# EAGLE design ESP8266 Encoder (EAGLE 9.6.2)
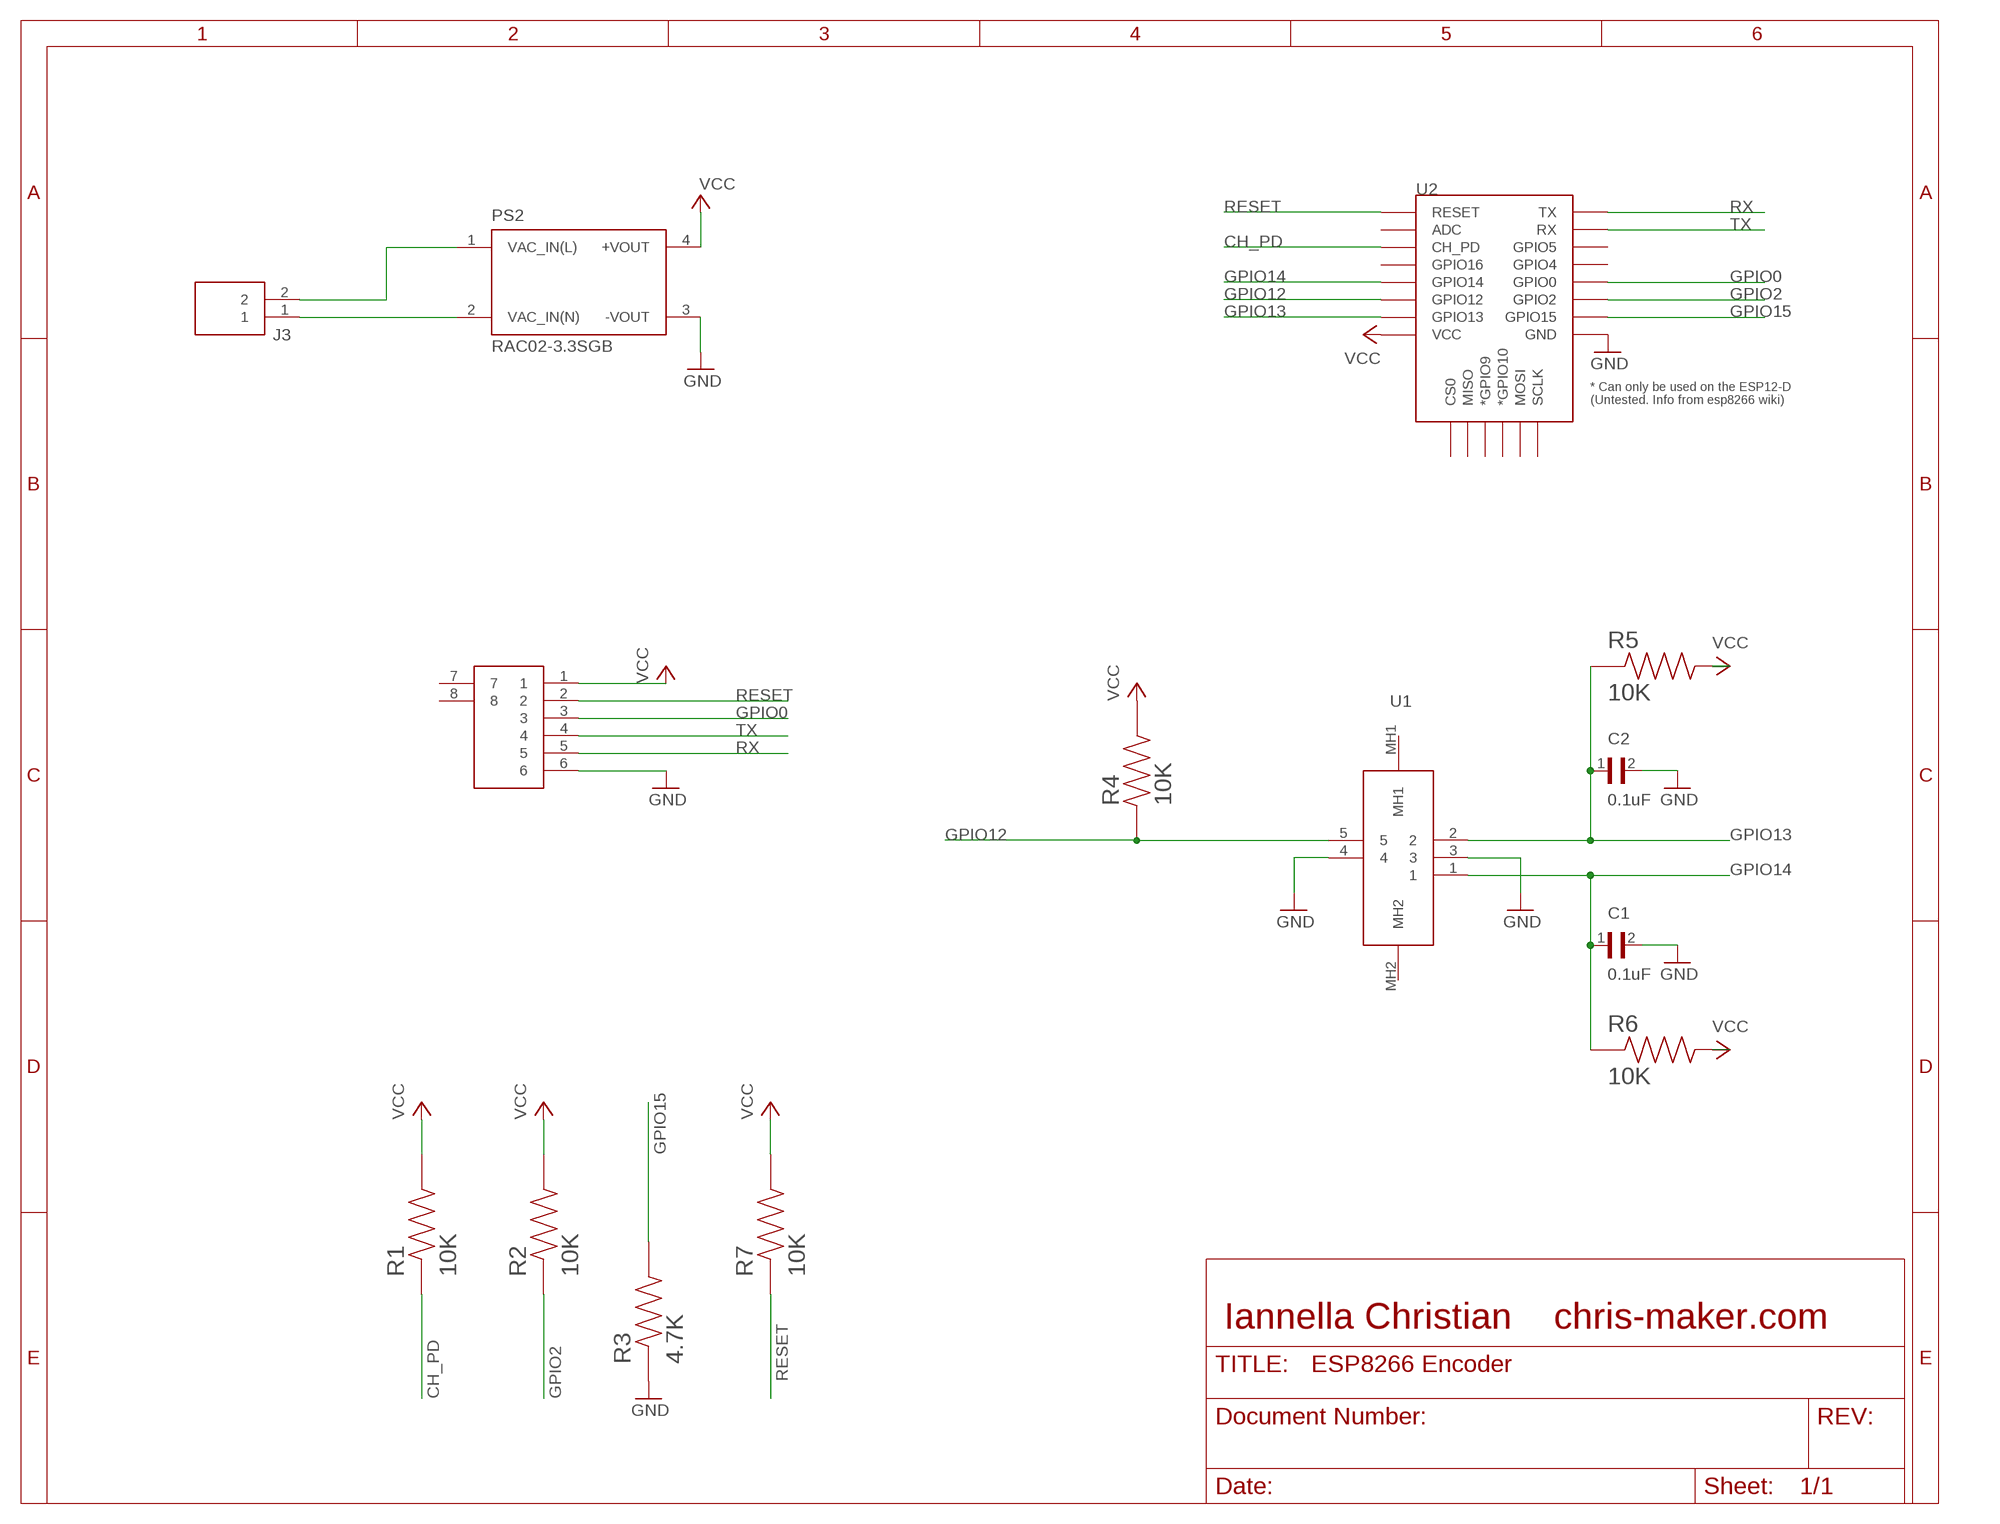
[diagram p0: schematic, sheet 1]

## Parts
C1  0.1uF  0805YC103J4T2A  [CAPC2012X94N]
C2  0.1uF  0805YC103J4T2A  [CAPC2012X94N]
J1  52852-0670  [528520670]
J3  TB004-508-02BE  [SHDR2W100P0X508_1X2_1016X1020X]
PS2  RAC02-3.3SGB  [CONV_RAC02-3.3SGB]
R1  10K  RC0805FR-07330RL  [RESC2012X60N]
R2  10K  RC0805FR-07330RL  [RESC2012X60N]
R3  4.7K  RC0805FR-07330RL  [RESC2012X60N]
R4  10K  RC0805FR-07330RL  [RESC2012X60N]
R5  10K  RC0805FR-07330RL  [RESC2012X60N]
R6  10K  RC0805FR-07330RL  [RESC2012X60N]
R7  10K  RC0805FR-07330RL  [RESC2012X60N]
U1  ENCODER90  [EN11VSM0AF20]
U2  ESP12ESMD  [ESP12E-SMD]

## Nets
CH_PD: R1.1 U2.CH_PD
GND: C1.2 C2.2 J1.6 PS2.3(-VOUT) R3.1 U1.3 U1.4 U2.GND
GPIO0: J1.3 U2.GPIO0
GPIO2: R2.1 U2.GPIO2
GPIO12: R4.1 U1.5 U2.GPIO12
GPIO13: C2.1 R5.1 U1.2 U2.GPIO13
GPIO14: C1.1 R6.1 U1.1 U2.GPIO14
GPIO15: R3.2 U2.GPIO15
N$1: J3.2 PS2.1(VAC_IN(L))
N$2: J3.1 PS2.2(VAC_IN(N))
RESET: J1.2 R7.1 U2.RESET
RX: J1.5 U2.TXD0(TX)
TX: J1.4 U2.RXD0(RX)
VCC: J1.1 PS2.4(+VOUT) R1.2 R2.2 R4.2 R5.2 R6.2 R7.2 U2.VCC
Unconnected: J1.7 J1.8 U1.MH1 U1.MH2 U2.ADC U2.CS0 U2.GPIO4 U2.GPIO5 U2.GPIO9(*GPIO9) U2.GPIO10(*GPIO10) U2.GPIO16 U2.MISO U2.MOSI U2.SCLK

## Notes on the sheet
- Iannella Christian    chris-maker.com

## Library data of the parts
C1 C2 = 0805YC103J4T2A:0805YC103J4T2A: Cap Ceramic 0.01uF 16V X7R 5% SMD 0805 125°C Paper T/R Check availability <https://pricing.snapeda.com/parts/0805YC103J4T2A/AVX/view-part?ref=eda>; AVAILABILITY: In Stock; DESCRIPTION: 10000 pF ±5% 16V Ceramic Capacitor X7R 0805 (2012 Metric); MF: AVX; MP: 0805YC103J4T2A; PACKAGE: 2012 AVX; PRICE: None; PURCHASE-URL: https://pricing.snapeda.com/search/part/0805YC103J4T2A/?ref=eda
J1 = 52852-0670:52852-0670: FFC & FPC Connectors 1.0 FFC Non ZIF SMT HsgAssy6CktEmbsTpPkg Source: Datasheet <https://www.molex.com/pdm_docs/sd/528520670_sd.pdf>; DESCRIPTION: FFC & FPC Connectors 1.0 FFC Non ZIF SMT HsgAssy6CktEmbsTpPkg; HEIGHT: 3mm; MANUFACTURER_NAME: Molex; MANUFACTURER_PART_NUMBER: 52852-0670; MOUSER_PART_NUMBER: 538-52852-0670; MOUSER_PRICE-STOCK: https://www.mouser.co.uk/ProductDetail/Molex/52852-0670?qs=%252BdbFUiYBkDZQc5IPgvIwgQ%3D%3D
J3 = TB004-508-02BE:TB004-508-02BE: Fixed Terminal Blocks Terminal block, screw type, 5.08 , horizontal, 2 poles, CUI Blue, slotted screw, PCB mount Source: Datasheet <https://componentsearchengine.com/Datasheets/1/TB004-508-02BE.pdf>; DESCRIPTION: Fixed Terminal Blocks Terminal block, screw type, 5.08 , horizontal, 2 poles, CUI Blue, slotted screw, PCB mount; HEIGHT: 14.1mm; MANUFACTURER_NAME: CUI Devices; MANUFACTURER_PART_NUMBER: TB004-508-02BE; MOUSER_PART_NUMBER: 490-TB004-508-02BE; MOUSER_PRICE-STOCK: https://www.mouser.co.uk/ProductDetail/CUI-Devices/TB004-508-02BE?qs=vLWxofP3U2zLwdGzG2tSkA%3D%3D
PS2 = RAC02-3.3SGB:RAC02-3.3SGB: AC/DC Converter, 2 Watt, Single Output, EMC Class B Check prices <https://pricing.snapeda.com/parts/RAC02-3.3SGB/Recom%20Power/view-part?ref=eda>; DESCRIPTION: 2W AC/DC-Converter 'POWERLINE' 3kV reg; MF: Recom Power; MP: RAC02-3.3SGB; PACKAGE: DIP-4 Recom Power; PRICE: None
R1-R7 = RC0805FR-07330RL:RC0805FR-07330RL: Resistor SMD [YAGEO] RC0805FR-07330RL Resistor SMD Check availability <https://pricing.snapeda.com/parts/RC0805FR-07330RL/Yageo/view-part?ref=eda>; AVAILABILITY: In Stock; DESCRIPTION: 330 Ohms ±1% 0.125W, 1/8W Chip Resistor 0805 (2012 Metric) Moisture Resistant Thick Film; MF: Yageo; MP: RC0805FR-07330RL; PACKAGE: 2012 Rohm Semiconductor; PRICE: None; PURCHASE-URL: https://pricing.snapeda.com/search/part/RC0805FR-07330RL/?ref=eda
U1 = EN11-VSM0AF20:ENCODER90: Encoders 11mm Source: Datasheet; DESCRIPTION: Encoders 11mm; HEIGHT: 13.75mm; MANUFACTURER_NAME: TT Electronics; MANUFACTURER_PART_NUMBER: EN11-VSM0AF20
U2 = esp8266modules:ESP12E: ESP12E Module

## Board
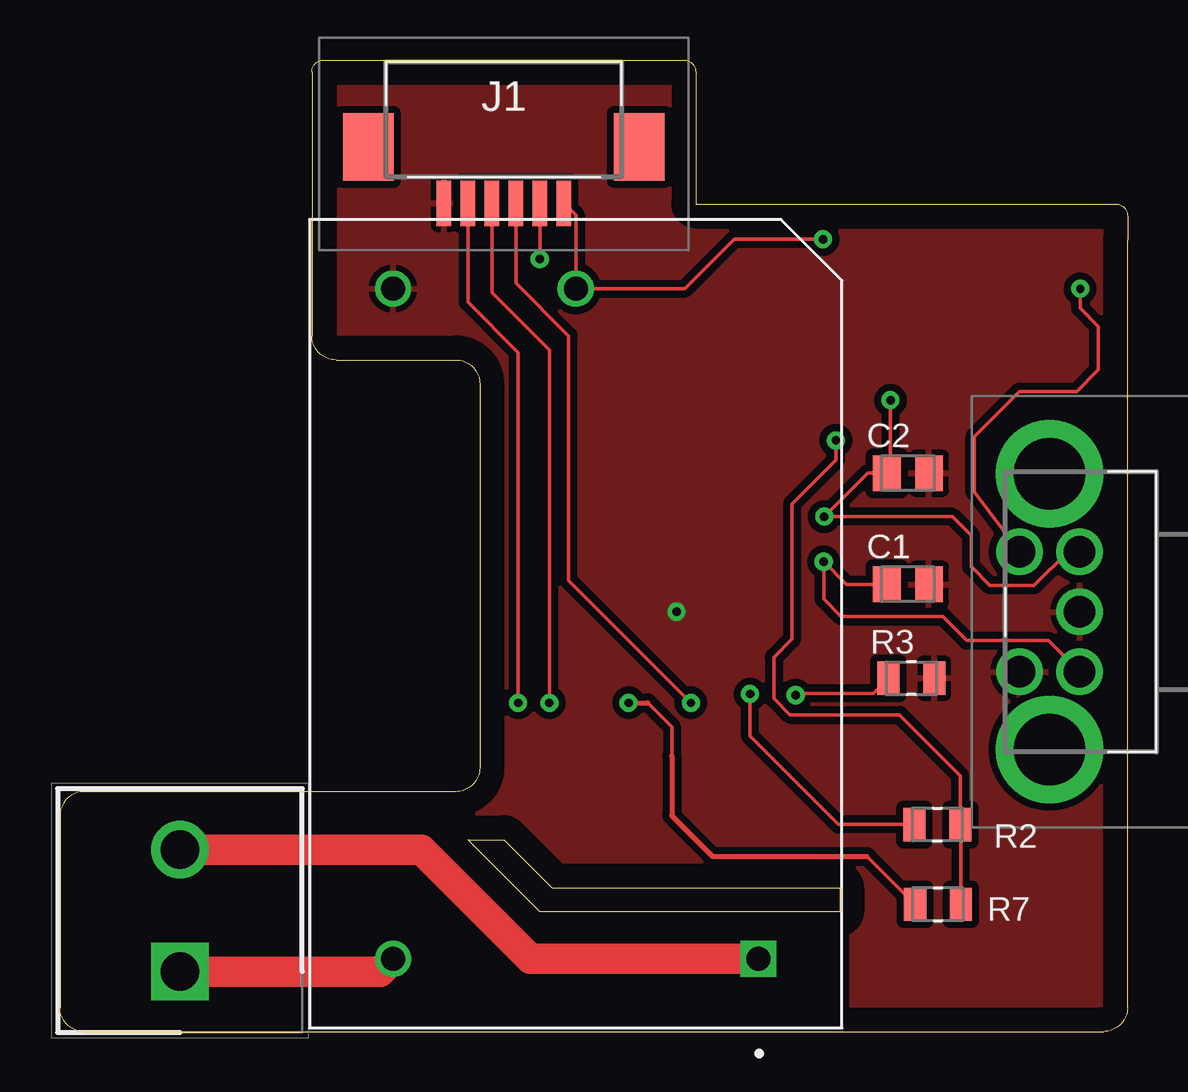
[diagram p1: board, top side]
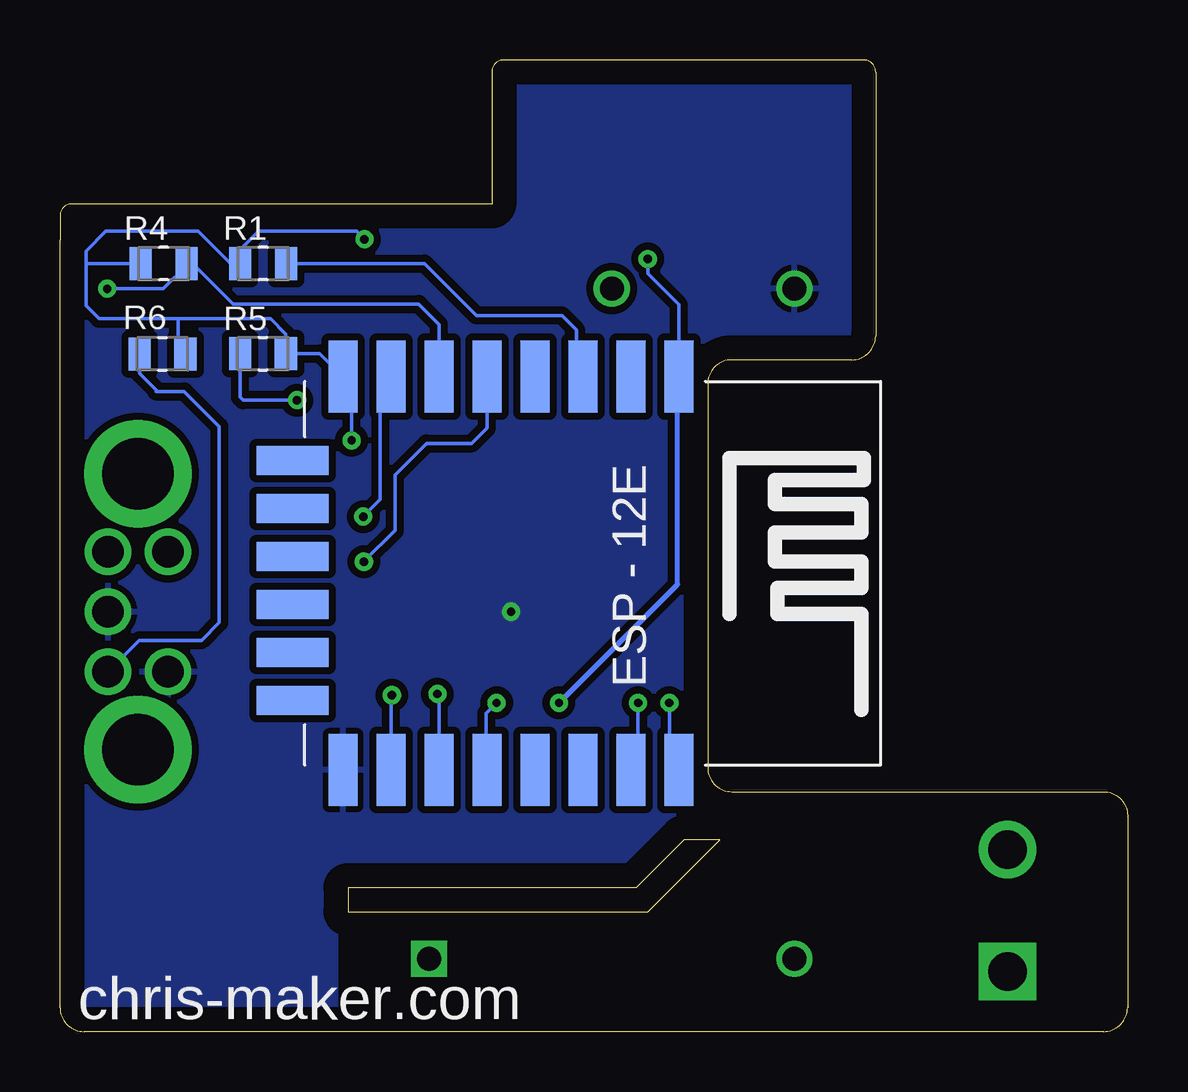
[diagram p2: board, bottom side, seen from below]

Size 44.5 x 40.5 mm. Coordinates in mm from the lower left corner, seen from the top.
Outline: 1,0 43.5,0 arc90 44.5,1 44.5,33 44.5,34 arc90 44,34.5 26.5,34.5 26.5,40 arc90 26,40.5 11,40.5 arc90 10.5,40 10.5,29 arc90 11.5,28 16.5,28 arc-90 17.5,27 17.5,11 arc-90 16.5,10 1,10 arc90 0,9 0,1 arc90 1,0
Outline: 20.5,6 32.5,6 32.5,5 20,5 17,8 18.5,8 20.5,6
Copper layers (1*16): Top 0.035mm / dielectric 1.5mm / Bottom 0.035mm
Design rules "default": minimum track width 6mil, minimum drill 0.35mm, track to track 6mil, track to pad 6mil, pad to pad 6mil, via to via 6mil, smd to smd 6mil, copper to edge 40mil, drill to drill 6mil, minimum pad ring 10mil, minimum via ring 8mil, stop-mask expansion 4mil, vias tented up to drill 0mil, thermal gap 10mil

### Footprints (pad centres in the part's own frame; a part is rotated, then mirrored left to right if it is on the bottom)
CAPC2012X94N = smd 1.16 x 1.47: 1 -0.88,0; 2 0.88,0
528520670 = smd 0.6 x 1.9: 1 -2.5,2.475; 2 -1.5,2.475; 3 -0.5,2.475; 4 0.5,2.475; 5 1.5,2.475; 6 2.5,2.475 | smd 2.1 x 2.8: 7 -5.65,0.125; 8 5.65,0.125
SHDR2W100P0X508_1X2_1016X1020X = drill 1.6 pad 2.4 square: 1 0,0 | drill 1.6 pad 2.4: 2 5.08,0
CONV_RAC02-3.3SGB = drill 1 pad 1.5 square: 1 -13.97,-7.62 | drill 1 pad 1.5: 2 -13.97,7.62; 3 13.97,7.62; 4 13.97,0
RESC2012X60N = smd 0.92 x 1.38: 1 -0.955,0; 2 0.955,0
EN11VSM0AF20 = drill 1.3 pad 1.95: 1 0,0; 2 0,5; 3 0,2.5; 4 -2.5,0; 5 -2.5,5 | drill 2.973 pad 4.46: MH1 -1.25,8.25; MH2 -1.25,-3.25
ESP12E-SMD = smd 3 x 1.2: ADC -8.3,3.8; CH_PD -8.3,1.8; GND 8.1,-8.2; GPIO0 8.1,-2.2; GPIO2 8.1,-4.2; GPIO4 8.1,-0.2; GPIO5 8.1,1.8; GPIO12 -8.3,-4.2; GPIO13 -8.3,-6.2; GPIO14 -8.3,-2.2; GPIO15 8.1,-6.2; GPIO16 -8.3,-0.2; RESET -8.3,5.8; RXD0 8.1,3.8; TXD0 8.1,5.8; VCC -8.3,-8.2 | smd 1.2 x 3: CS0 -4.8,-10.3; GPIO9 -0.8,-10.3; GPIO10 1.2,-10.3; MISO -2.8,-10.3; MOSI 3.2,-10.3; SCLK 5.2,-10.3

### Placement (x,y rotation side)
C1  35.35,18.64 0 top
C2  35.35,23.27 0 top
J1  18.5,37 180 top
J3  5,2.5 90 top
PS2  21.5,17 90 top
R1  36.03,32.02 180 bottom
R2  36.57,8.63 0 top
R3  35.49,14.73 180 top
R4  40.18,32.02 180 bottom
R5  36.04,28.25 0 bottom
R6  40.22,28.24 0 bottom
R7  36.6,5.3 0 top
U1  42.5,15 0 top
U2  24.5,19 270 bottom

### Tracks (layer width: path | path; a pad name or v marks a point on that pad's centre or on a via)
CH_PD
  Bottom 0.152: U2.CH_PD 22.97,27.57 22.97,29.23 23.58,29.84 27.14,29.84 29.31,32.02 R1.1
GND  (via drill 0.35)
  other vias: 25.7,17.5
  pour Top (isolate 0.3): 45.5,41 45.5,-0.5 33,-0.5 33,6 20.5,6 16.5,10 9.5,10 9.5,41
  pour Bottom (isolate 0.3): 46,-0.5 33,-0.5 33,6 9.5,6 9.5,41.5 46,41.5
GPIO0  (via drill 0.35)
  Top 0.152: v26.3,13.7 21.2,18.8 21.2,29 19,31.2 J1.3
  Bottom 0.152: U2.GPIO0 26.73,10.93 26.73,13.27 v26.3,13.7
GPIO2  (via drill 0.35)
  Top 0.152: R2.1 32.45,8.63 28.76,12.32 v28.76,14.07
  Bottom 0.152: U2.GPIO2 28.7,14.01 v28.76,14.07
GPIO12  (via drill 0.35)
  Top 0.152: U1.5 38.12,22.48 38.12,24.81 39.99,26.68 42.38,26.68 43.29,27.6 43.29,29.39 42.53,30.15 v42.53,30.96
  Bottom 0.152: U2.GPIO12 28.7,29.48 29.55,30.33 37.28,30.33 39.05,32.1 39.18,31.97 | R4.1 39.18,31.97 | v42.53,30.96 40.19,30.96 39.18,31.97
GPIO13  (via drill 0.35)
  Top 0.152: v34.62,26.32 34.62,23.43 C2.1 33.67,23.27 v31.86,21.46 37.2,21.46 37.98,20.68 37.98,19.38 38.76,18.6 40.6,18.6 42,20 U1.2
  Bottom 0.152: v31.86,21.46 31.16,22.17 31.16,26.84 U2.GPIO13 | v34.62,26.32 36.87,26.32 36.99,26.44 R5.1
GPIO14  (via drill 0.35)
  Top 0.152: C1.1 32.77,18.64 v31.84,19.58 31.84,18.03 32.56,17.31 36.8,17.31 37.8,16.31 37.8,16.3 41.2,16.3 U1.1
  Bottom 0.152: v31.84,19.58 30.54,20.88 30.54,23.19 29.22,24.51 27.34,24.51 26.7,25.15 U2.GPIO14 | R6.1 41.18,27.42 40.49,26.73 40.49,26.69 39.32,26.69 37.86,25.22 37.86,17.04 38.6,16.3 41.2,16.3 U1.1
GPIO15  (via drill 0.35)
  Top 0.152: v30.67,14.02 30.74,14.1 33.9,14.1 R3.2
  Bottom 0.152: U2.GPIO15 30.7,13.99 v30.67,14.02
N$1
  Top 1.27: PS2.1 19.61,3.03 15.06,7.58 J3.2
N$2
  Top 1.27: J3.1 13.35,2.5 PS2.2
RESET  (via drill 0.35)
  Top 0.152: 33.64,7.3 R7.1 | 24.5,13.7 25.5,12.7 25.5,11.5 | J1.2 v20,32.2
  Top 0.2: v23.7,13.7 24.5,13.7 | 33.64,7.3 27.2,7.3 25.5,9 25.5,11.5
  Bottom 0.152: 18.75,27.5 18.75,27.36 U2.RESET 18.7,30.3 20,31.6 v20,32.2
  Bottom 0.2: v23.7,13.7 18.75,18.64 18.75,27.5
RX  (via drill 0.35)
  Top 0.152: v19.1,13.7 19.1,28.3 17,30.4 J1.5
  Bottom 0.152: v19.1,13.7 19.1,11.3 U2.TXD0
TX  (via drill 0.35)
  Top 0.152: v20.4,13.7 20.4,28.4 18,30.8 J1.4
  Bottom 0.152: v20.4,13.7 20.4,11.2 U2.RXD0
VCC  (via drill 0.35)
  Top 0.152: v31.81,33.03 28.11,33.03 26.05,30.97 PS2.4 21.5,34.02 J1.1 | v32.34,24.64 32.34,23.82 30.52,22 30.52,16.36 29.75,15.6 29.75,13.88 30.43,13.2 34.99,13.2 37.53,10.66 R2.2 37.55,8.6 R7.2
  Bottom 0.152: v31.81,33.03 32.14,33.36 36.22,33.36 37.28,32.3 R1.2 37.39,32.02 38.73,33.36 42.59,33.36 43.41,32.54 43.41,32.02 | 43.41,32.02 43.41,30.25 42.87,29.72 39.58,29.72 | 39.58,29.72 35.72,29.72 35.08,29.08 R5.2 35.07,28.27 33.67,28.27 U2.VCC 32.34,26.94 v32.34,24.64 | R4.2 43.41,32.02 | R6.2 39.58,28.56 39.58,29.72

### Text on the board
bPlace: chris-maker.com